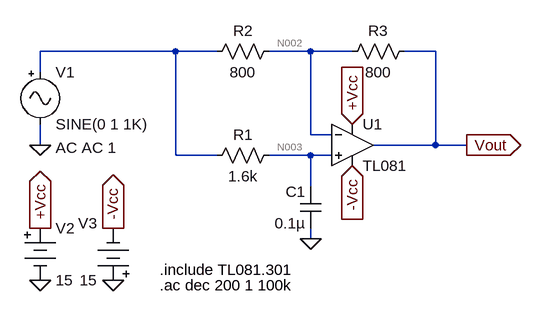
[diagram p0: schematic First-Order All-Pass.asc]
First-Order All-Pass.asc, the LTspice schematic file:
Version 4
SHEET 1 880 680
WIRE -48 64 -256 64
WIRE 16 64 -48 64
WIRE 160 64 96 64
WIRE 224 64 160 64
WIRE 352 64 304 64
WIRE -256 96 -256 64
WIRE 160 192 160 64
WIRE 192 192 160 192
WIRE -256 208 -256 176
WIRE 352 208 352 64
WIRE 352 208 256 208
WIRE 400 208 352 208
WIRE -48 224 -48 64
WIRE 16 224 -48 224
WIRE 160 224 96 224
WIRE 192 224 160 224
WIRE 160 272 160 224
WIRE 160 352 160 336
FLAG -256 208 0
FLAG 400 208 Vout
IOPIN 400 208 Out
FLAG 160 352 0
FLAG 224 176 +Vcc
IOPIN 224 176 In
FLAG 224 240 -Vcc
IOPIN 224 240 In
FLAG -256 416 0
FLAG -144 416 0
FLAG -256 336 +Vcc
IOPIN -256 336 Out
FLAG -144 336 -Vcc
IOPIN -144 336 Out
SYMBOL OpAmps\\opamp2 224 144 R0
SYMATTR InstName U1
SYMATTR Value TL081
SYMBOL res 112 208 R90
WINDOW 0 0 56 VBottom 2
WINDOW 3 32 56 VTop 2
SYMATTR InstName R1
SYMATTR Value 1.6k
SYMBOL res 112 48 R90
WINDOW 0 0 56 VBottom 2
WINDOW 3 32 56 VTop 2
SYMATTR InstName R2
SYMATTR Value 800
SYMBOL res 320 48 R90
WINDOW 0 0 56 VBottom 2
WINDOW 3 32 56 VTop 2
SYMATTR InstName R3
SYMATTR Value 800
SYMBOL cap 176 336 R180
WINDOW 0 24 56 Left 2
WINDOW 3 24 8 Left 2
SYMATTR InstName C1
SYMATTR Value 0.1µ
SYMBOL Misc\\signal -256 80 R0
WINDOW 123 24 132 Left 2
WINDOW 39 0 0 Left 0
SYMATTR Value2 AC AC 1
SYMATTR InstName V1
SYMBOL Misc\\battery -256 320 R0
WINDOW 123 0 0 Left 0
WINDOW 39 0 0 Left 0
SYMATTR InstName V2
SYMATTR Value 15
SYMBOL Misc\\battery -144 432 R180
WINDOW 0 24 104 Left 2
WINDOW 3 24 16 Left 2
WINDOW 123 0 0 Left 0
WINDOW 39 0 0 Left 0
SYMATTR InstName V3
SYMATTR Value 15
TEXT -72 400 Left 2 !.include TL081.301
TEXT -72 424 Left 2 !.ac dec 200 1 100k

The netlist it stands for:
* First-Order All-Pass.asc
XU1 N003 N002 +Vcc -Vcc Vout TL081  ; pins In+ In- V+ V- OUT
R1 N003 N001 1.6k
R2 N002 N001 800
R3 Vout N002 800
C1 0 N003 0.1µ
V1 N001 0 SINE(0 1 1K) AC AC 1
V2 +Vcc 0 15
V3 0 -Vcc 15
.include TL081.301
.ac dec 200 1 100k
.backanno
.end

* Results of the author's LTspice run, read from the files saved beside the schematic
* Operating Point, zero values left out:
*   V(vout) = 21.83 µV
*   V(-vcc) = -15 V
*   V(+vcc) = 15 V
*   V(n002) = 10.9 µV
*   V(n003) = -72.09 nV
*   I(R1) = -45.05 pA
*   I(R2) = 13.62 nA
*   I(R3) = 13.67 nA
*   I(V1) = 13.58 nA
*   I(V2) = -14.19 mA
*   I(V3) = -14.19 mA
*   Ix(u1:1) = 45.05 pA
*   Ix(u1:2) = 45.05 pA
*   Ix(u1:3) = 14.19 mA
*   Ix(u1:4) = -14.19 mA
*   Ix(u1:5) = -13.67 nA
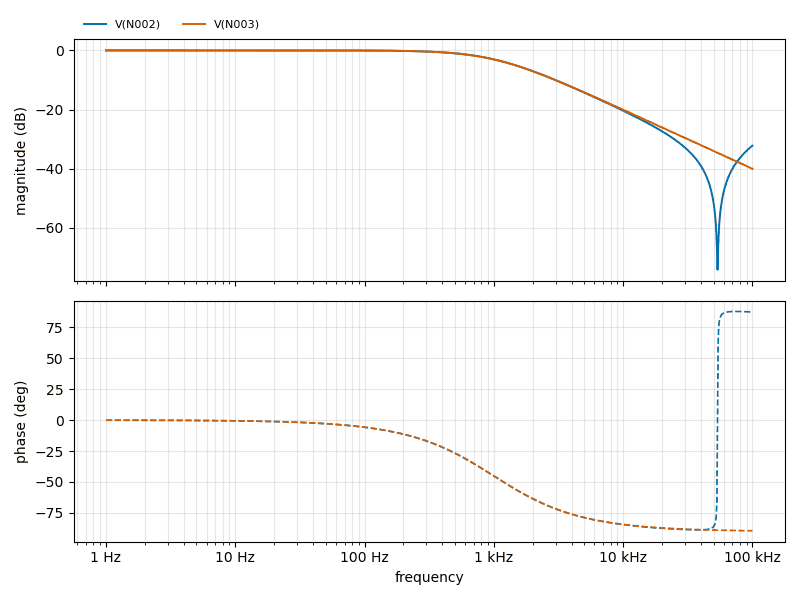
[diagram p1: AC Analysis of First-Order All-Pass.asc, plotted from the saved traces]
* AC Analysis, 1 run:
*   V(N002): -0.00 dB at 1 Hz, -32.22 dB at 100 kHz, peak -0.00 dB at 1 Hz, 3 dB below the peak at 994 Hz
*   V(N003): -0.00 dB at 1 Hz, -40.05 dB at 100 kHz, peak -0.00 dB at 1 Hz, 3 dB below the peak at 994.7 Hz